# Altium schematic sheet AtlasControl-A1.01.01E.SchDoc: ATLAS-CONTROL-A1
size A4; Revision: 01; SheetNumber: 6; SheetTotal: 7
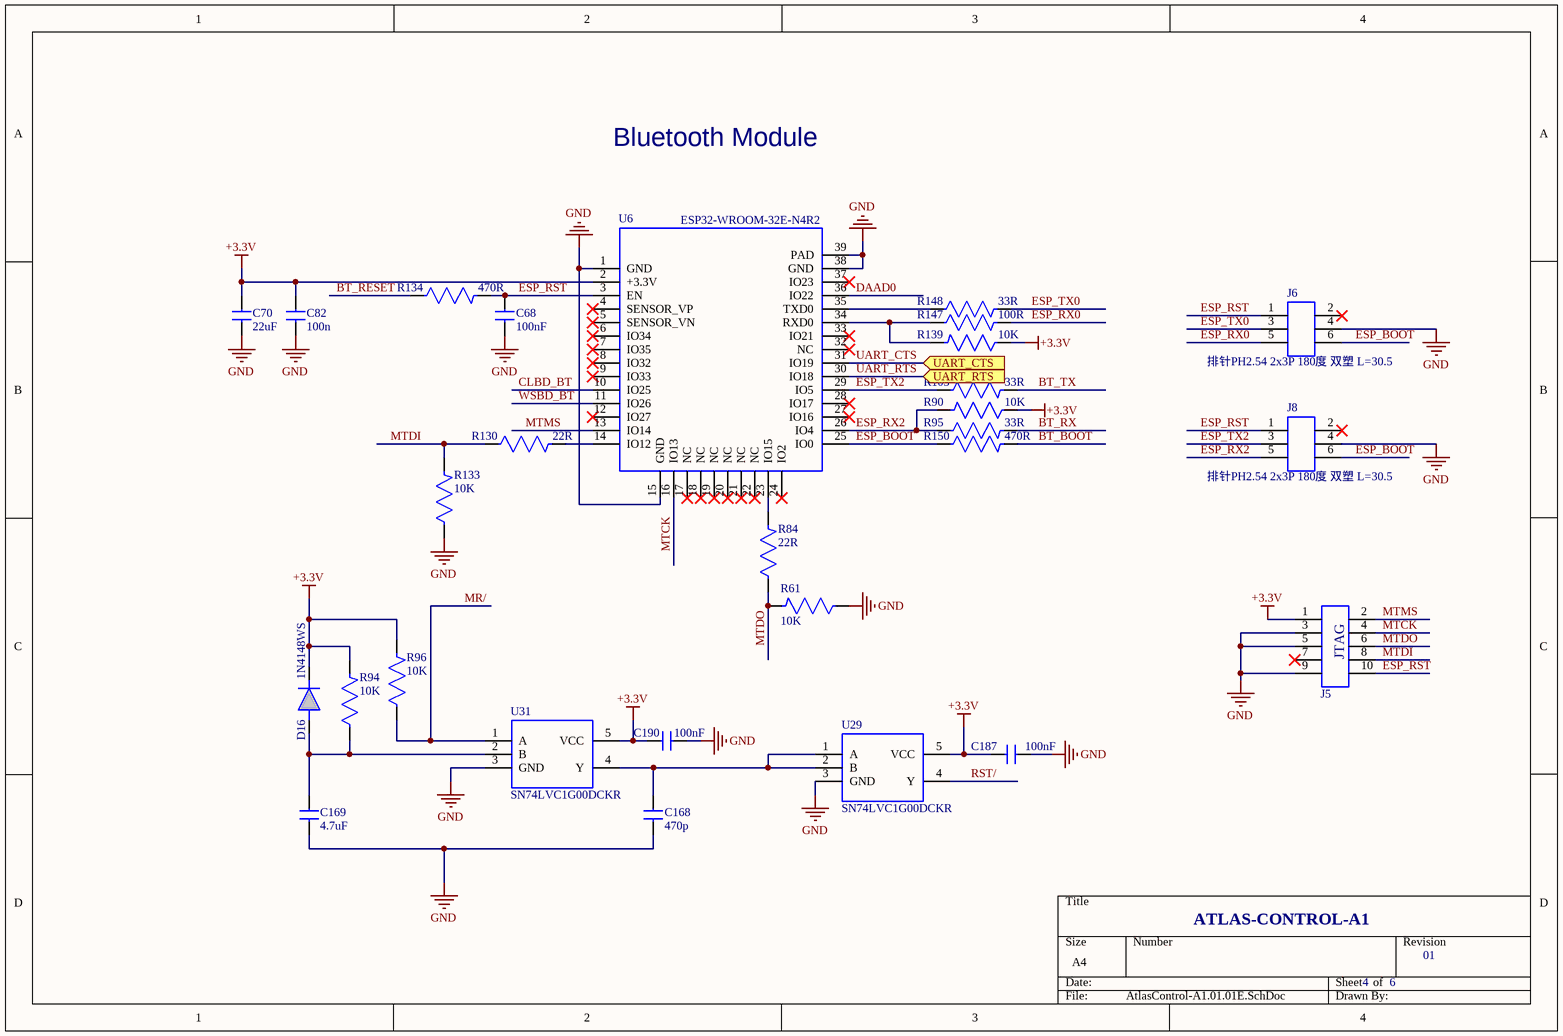
[diagram p0: AtlasControl-A1.01.01E.SchDoc]

## Parts
C68  100nF  [0402]
C70  22uF  [0603]
C82  100n  [0603]
C168  470p  [0402]
C169  4.7uF  [0603]
C187  100nF  [0402]
C190  100nF  [0402]
D16  1N4148WS  [SOD-323]
J5  W208V10T00  [ph2.0-2*5P 180° Double plastic]  (value not drawn)
J6  排针PH2.54 2x3P 180度 双塑 L=30.5  [PH2.54 2x3P 180° Double plastic]
J8  排针PH2.54 2x3P 180度 双塑 L=30.5  [PH2.54 2x3P 180° Double plastic]
R61  10K  [0603]
R84  22R  [0603]
R90  10K  [0603]
R94  10K  [0402]
R95  33R  [0603]
R96  10K  [0603]
R103  33R  [0603]
R130  22R  [0603]
R133  10K  [0603]
R134  470R  [0402]
R139  10K  [0402]
R147  100R  [0402]
R148  33R  [0402]
R150  470R  [0402]
U6  ESP32-WROOM-32E-N4R2  [ESP32-WROOM-32E]
U29  SN74LVC1G00DCKR  [SC70]
U31  SN74LVC1G00DCKR  [SC70]

## Ports
UART_CTS (in), UART_RTS (in)

## Nets
+3.3V: C70.1 C82.1 C187.1 C190.1 D16.1(K) J5.1 R90.1 R94.2 R96.2 R139.1 U6.2(+3.3V) U29.5(VCC) U31.5(VCC)
GND: C68.1 C70.2 C82.2 C168.2 C169.2 C187.2 C190.2 J5.3 J5.5 J5.9 J6.4 J8.4 R61.1 R133.1 U6.1(GND) U6.15(GND) U6.38(GND) U6.39(PAD) U29.3(GND) U31.3(GND)
BT_BOOT: R150.2
BT_RESET: R134.1
BT_RX: R95.2
BT_TX: R103.2
CLBD_BT: U6.10(IO25)
DAAD0: U6.36(IO22)
ESP_BOOT: J6.6 J8.6 R150.1 U6.25(IO0)
ESP_RST: C68.2 J5.10 J6.1 J8.1 R134.2 U6.3(EN)
ESP_RX0: J6.5 R147.2
ESP_RX2: J8.5 R90.2 R95.1 U6.26(IO4)
ESP_TX0: J6.3 R148.2
ESP_TX2: J8.3 R103.1 U6.29(IO5)
MR/: R96.1 U31.1(A)
MTCK: J5.4 U6.16(IO13)
MTDI: J5.8 R130.1 R133.2
MTDO: J5.6 R61.2 R84.1
MTMS: J5.2 U6.13(IO14)
RST/: U29.4(Y)
UART_CTS: U6.31(IO19) ; port UART_CTS
UART_RTS: U6.30(IO18) ; port UART_RTS
WSBD_BT: U6.11(IO26)
NetC168_1: C168.1 U29.1(A) U29.2(B) U31.4(Y)
NetC169_1: C169.1 D16.2(A) R94.1 U31.2(B)
NetR84_2: R84.2 U6.23(IO15)
NetR130_2: R130.2 U6.14(IO12)
NetR139_2: R139.2 R147.1 U6.34(RXD0)
NetR148_1: R148.1 U6.35(TXD0)

Not connected (* = marked no-connect by the designer): J5 7*; J6 2*; J8 2*; U6 4(SENSOR_VP)* 5(SENSOR_VN)* 6(IO34)* 7(IO35)* 8(IO32)* 9(IO33)* 12(IO27)* 17(NC)* 18(NC)* 19(NC)* 20(NC)* 21(NC)* 22(NC)* 24(IO2)* 27(IO16)* 28(IO17)* 32(NC)* 33(IO21)* 37(IO23)*

## Notes on the sheet
- Bluetooth Module
- (near J5) JTAG
- 4
- 6

## Library data of the parts
C68 = CAP/CE/0402/50V/100NF/10%: 贴片电容100n(ROHS); MANUFACTURER: 上海博奥电子有限公司; PART NUMBER: 417A; *CRLF**: cost"; MODEL: C0402-100n-50V-10%-X7R; Tolerance: 10%; Voltage Rating: 50V; PKG TYPE: 0402; VALUE: 100nF
C70 = CAP/CE/0603/10V/22UF/20%: 贴片电容22u; MANUFACTURER: 上海博奥电子有限公司; PART NUMBER: A1570; MODEL: C0603-22u-10V-20%-X5R; TOL: 20%; VOLT: 10V; PKG TYPE: 0603; VALUE: 22uF
C82 = CAP/CE/0603/50V/100NF/10%: 贴片电容100n(ROHS); MANUFACTURER: 上海博奥电子有限公司; PART NUMBER: A1578; *CRLF**: cost"; MODEL: CL10B104KB8NNNC; Tolerance: 10%; Voltage Rating: 50V; PKG TYPE: 0603; VALUE: 100n
C168 = CAP/CE/0402/50V/470PF/5%/COG: 贴片电容470p; PART NUMBER: A1563; MODEL: C0402-470p-50V-5%-COG; Tolerance: 5%; Voltage Rating: 50V; PKG TYPE: 0402; VALUE: 470p
C169 = CAP/CE/0603/16V/4.7UF/10%: 贴片电容4.7u(ROHS); MANUFACTURER: 上海博奥电子有限公司; PART NUMBER: B1514; *CRLF**: cost"; MODEL: C0603-4.7u-16V-10％-X5R; Tolerance: 10%; Voltage Rating: 16V; Manufacturer #2: *; PKG TYPE: 0603; VALUE: 4.7uF
C187 C190 = CAP/CE/0402/16V/100NF/5%: 贴片电容100n(ROHS); MANUFACTURER: 上海博奥电子有限公司; PART NUMBER: A1504; *CRLF**: cost"; MODEL: C0402-100nF-16V-5％; Tolerance: 5%; Voltage Rating: 16V; PKG TYPE: 0402; VALUE: 100nF
D16 = DIODE/1N4148WS/SOD-323: 开关二极管(JSCJ); PART NUMBER: 1747; *CRLE**: Cost''; MANUFACTURER: JSCJ; MODEL: 1N4148WS/SOD-323; PKG TYPE: SOD-323; VALUE: 1N4148WS
J5 = CON/PH2.0 2*5P/W208V10T00: 双排插座PH2.0 2*5P; PART NUMBER: A13437; MANUFACTURER: 深圳市欧朗电子有限公司; Cost: *; Value: W208V10T00; MODEL: W208V10T00
J6 J8 = CON/PH2.54 2x3P straight Double plastic L=30.5: 双排针3P; MANUFACTURER: 深圳市欧朗电子有限公司; PART NUMBER: 11663; MODEL: 排针PH2.54 2x3P 180度 双塑 L=30.5; Value: 排针PH2.54 2x3P 180度 双塑 L=30.5
R61 R90 R96 R133 = RES/CE/0603/10K/1%: 贴片电阻10K(ROHS); MANUFACTURER: 上海博奥电子有限公司; PART NUMBER: 353; *CRLF**: cost"; MODEL: R0603-10K-1/10W-1％; PKG TYPE: 0603; VALUE: 10K
R84 R130 = RES/CE/0603/22R/5%: 贴片电阻22R(ROHS); MANUFACTURER: 上海博奥电子有限公司; PART NUMBER: 336; *CRLF**: cost"; MODEL: R0603-22R-1/10W-5％; PKG TYPE: 0603; VALUE: 22R
R94 R139 = RES/CE/0402/10K/1%: 贴片电阻10K; MANUFACTURER: 上海博奥电子有限公司; PART NUMBER: A308; *CRLF**: cost"; MODEL: R0402-10K-1/16W-1%; PKG TYPE: 0402; VALUE: 10K
R95 R103 = RES/CE/0603/33R/1％: 贴片电阻33R(ROHS); MANUFACTURER: 上海博奥电子有限公司; PART NUMBER: A182; MODEL: R0603-33R-1/10W-1％; Cost: *; PKG TYPE: 0603; VALUE: 33R
R134 R150 = RES/CE/0402/470R/1%: 贴片电阻470R; PART NUMBER: A306; *CRLF**: cost"; MODEL: R0402-470R-1/16W-1%; PKG TYPE: 0402; VALUE: 470R
R147 = RES/CE/0402/100R/1%: 贴片电阻100R; MANUFACTURER: 上海博奥电子有限公司; PART NUMBER: A313; *CRLF**: cost"; MODEL: R0402-100R-1/16W-1%; PKG TYPE: 0402; VALUE: 100R
R148 = RES/CE/0402/33R/1%: 贴片电阻33R(ROHS); MANUFACTURER: 深圳市万联芯科技有限公司; PART NUMBER: D234; MODEL: R0402-33R-1/16W-1%; *CRLF**: cost"; PKG TYPE: 0402; VALUE: 33R
U6 = IC/WiFi MCU MODULE/ESP32-WROOM-32E-N4R2: Wi-Fi模块; MANUFACTURER: ESPRESSIF; MODEL: ESP32-WROOM-32E-N4R2; VALUE: ESP32-WROOM-32E-N4R2
U29 U31 = IC/LOG/SN74LVC1G00DCKR/SC70: 触发器(ROHS); MANUFACTURER: TI; PART NUMBER: 7691; MODEL: SN74LVC1G00DCKR/SC70; Value: SN74LVC1G00DCKR